# Altium project Modbus_controller.PrjPcb (part 1 of 2)
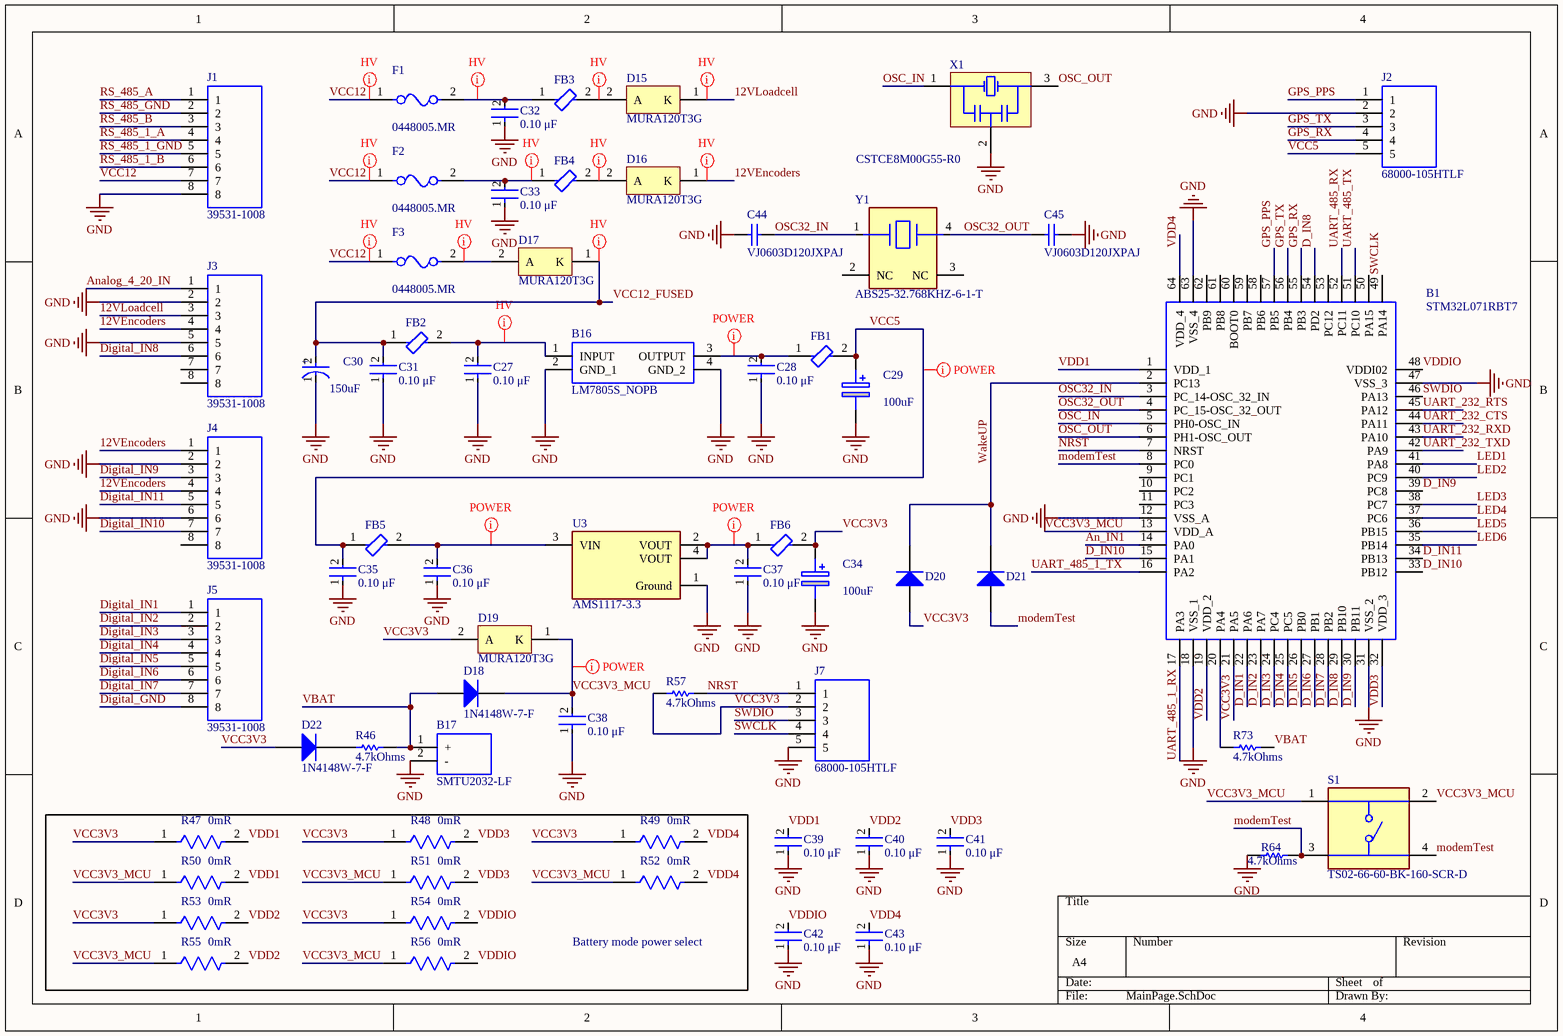
[diagram p0: MainPage.SchDoc]
6 sheets, 195 parts. Net scope: global (net labels, ports and power ports of the same name join across sheets).
Board file: Modbus_PCB1.PcbDoc
Sheets:
  MainPage.SchDoc
  RS_232.SchDoc
  InputCircuits.SchDoc
  InputCircuits1.SchDoc
  indication.SchDoc
  RS_485.SchDoc

## Sheet MainPage.SchDoc
size A4; SheetNumber: 1; SheetTotal: 6

### Parts
B1  STM32L071RBT7  [QFP50P1200X1200X160-64N]
B16  LM7805S_NOPB  [KTT0003B]
B17  SMTU2032-LF  [SMTU2032LF]
C27  value 0.10 μF  [FP-C0805C-DN-MFG]  (hidden comment: C0805C104K5RAC7411)
C28  value 0.10 μF  [FP-C0805C-DN-MFG]  (hidden comment: C0805C104K5RAC7411)
C29  Capacitance: 100uF  [T520B]  (hidden comment: T520B107M006ATE040)
C30  Capacitance: 150uF  [FP-TAJE-MFG]  (hidden comment: TAJE157K020RNJ)
C31  value 0.10 μF  [FP-C0805C-DN-MFG]  (hidden comment: C0805C104K5RAC7411)
C32  value 0.10 μF  [FP-C0805C-DN-MFG]  (hidden comment: C0805C104K5RAC7411)
C33  value 0.10 μF  [FP-C0805C-DN-MFG]  (hidden comment: C0805C104K5RAC7411)
C34  Capacitance: 100uF  [T520B]  (hidden comment: T520B107M006ATE040)
C35  value 0.10 μF  [FP-C0805C-DN-MFG]  (hidden comment: C0805C104K5RAC7411)
C36  value 0.10 μF  [FP-C0805C-DN-MFG]  (hidden comment: C0805C104K5RAC7411)
C37  value 0.10 μF  [FP-C0805C-DN-MFG]  (hidden comment: C0805C104K5RAC7411)
C38  value 0.10 μF  [FP-C0805C-DN-MFG]  (hidden comment: C0805C104K5RAC7411)
C39  value 0.10 μF  [FP-C0805C-DN-MFG]  (hidden comment: C0805C104K5RAC7411)
C40  value 0.10 μF  [FP-C0805C-DN-MFG]  (hidden comment: C0805C104K5RAC7411)
C41  value 0.10 μF  [FP-C0805C-DN-MFG]  (hidden comment: C0805C104K5RAC7411)
C42  value 0.10 μF  [FP-C0805C-DN-MFG]  (hidden comment: C0805C104K5RAC7411)
C43  value 0.10 μF  [FP-C0805C-DN-MFG]  (hidden comment: C0805C104K5RAC7411)
C44  VJ0603D120JXPAJ  [CAPC1608X92X38LL15T08]
C45  VJ0603D120JXPAJ  [CAPC1608X92X38LL15T08]
D15  MURA120T3G  [ONSC-SMA-2-403D-02_V]
D16  MURA120T3G  [ONSC-SMA-2-403D-02_V]
D17  MURA120T3G  [ONSC-SMA-2-403D-02_V]
D18  1N4148W-7-F  [DIOD-SOD123-2_V]
D19  MURA120T3G  [ONSC-SMA-2-403D-02_V]
D20  1N4148W-7-F  [DIOD-SOD123-2_V]  (value not drawn)
D21  1N4148W-7-F  [DIOD-SOD123-2_V]  (value not drawn)
D22  1N4148W-7-F  [DIOD-SOD123-2_V]
F1  0448005.MR  [FP-0448-MFG]
F2  0448005.MR  [FP-0448-MFG]
F3  0448005.MR  [FP-0448-MFG]
FB1  BLM41PG181SH1L  [FP-BLM41-0_2-a1_2-MFG]  (value not drawn)
FB2  BLM41PG181SH1L  [FP-BLM41-0_2-a1_2-MFG]  (value not drawn)
FB3  BLM41PG181SH1L  [FP-BLM41-0_2-a1_2-MFG]  (value not drawn)
FB4  BLM41PG181SH1L  [FP-BLM41-0_2-a1_2-MFG]  (value not drawn)
FB5  BLM41PG181SH1L  [FP-BLM41-0_2-a1_2-MFG]  (value not drawn)
FB6  BLM41PG181SH1L  [FP-BLM41-0_2-a1_2-MFG]  (value not drawn)
J1  39531-1008  [RHDR8W140P0X508_1X8_4264X830X1240P]
J2  68000-105HTLF  [HDRV5W67P0X254_1X5_1270X241X858P]
J3  39531-1008  [RHDR8W140P0X508_1X8_4264X830X1240P]
J4  39531-1008  [RHDR8W140P0X508_1X8_4264X830X1240P]
J5  39531-1008  [RHDR8W140P0X508_1X8_4264X830X1240P]
J7  68000-105HTLF  [HDRV5W67P0X254_1X5_1270X241X858P]
R46  Resistance: 4.7kOhms  [RESC1608X55X25LL10T15]  (hidden comment: RC0603FR-074K7L)
R47  Resistance: 0mR  [FP-CRCW0603-HPe3-MFG]  (hidden comment: CRCW06030000Z0EAHP)
R48  Resistance: 0mR  [FP-CRCW0603-HPe3-MFG]  (hidden comment: CRCW06030000Z0EAHP)
R49  Resistance: 0mR  [FP-CRCW0603-HPe3-MFG]  (hidden comment: CRCW06030000Z0EAHP)
R50  Resistance: 0mR  [FP-CRCW0603-HPe3-MFG]  (hidden comment: CRCW06030000Z0EAHP)
R51  Resistance: 0mR  [FP-CRCW0603-HPe3-MFG]  (hidden comment: CRCW06030000Z0EAHP)
R52  Resistance: 0mR  [FP-CRCW0603-HPe3-MFG]  (hidden comment: CRCW06030000Z0EAHP)
R53  Resistance: 0mR  [FP-CRCW0603-HPe3-MFG]  (hidden comment: CRCW06030000Z0EAHP)
R54  Resistance: 0mR  [FP-CRCW0603-HPe3-MFG]  (hidden comment: CRCW06030000Z0EAHP)
R55  Resistance: 0mR  [FP-CRCW0603-HPe3-MFG]  (hidden comment: CRCW06030000Z0EAHP)
R56  Resistance: 0mR  [FP-CRCW0603-HPe3-MFG]  (hidden comment: CRCW06030000Z0EAHP)
R57  Resistance: 4.7kOhms  [RESC1608X55X25LL10T15]  (hidden comment: RC0603FR-074K7L)
R64  Resistance: 4.7kOhms  [RESC1608X55X25LL10T15]  (hidden comment: RC0603FR-074K7L)
R73  Resistance: 4.7kOhms  [RESC1608X55X25LL10T15]  (hidden comment: RC0603FR-074K7L)
S1  TS02-66-60-BK-160-SCR-D  [SW_TS02-66-60-BK-160-SCR-D]
U3  AMS1117-3.3  [FP-AMS1117-IPC_C]
X1  CSTCE8M00G55-R0  [MURA-CSTCE_G_A-3_V]
Y1  ABS25-32.768KHZ-6-1-T  [FP-ABS25-MFG]

### Blocks framed on the sheet
Battery mode power select: R47-R56

### Nets
GND: B1.12(VSS_A) B1.18(VSS_1) B1.31(VSS_2) B1.47(VSS_3) B1.63(VSS_4) B16.2(GND_1) B16.4(GND_2) B17.2(-) C27.1 C28.1 C29.2(-) C30.1(C) C31.1 C32.1 C33.1 C34.2(-) C35.1 C36.1 C37.1 C38.1 C39.1 C40.1 C41.1 C42.1 C43.1 C44.1 C45.2 J1.8 J2.2 J3.2 J3.5 J4.2 J4.6 J7.5 R64.2 U3.1(Ground) X1.2(GND)
12VEncoders: D16.1(K) J3.4 J4.1 J4.4
12VLoadcell: D15.1(K) J3.3
An_IN1: B1.14(PA0)
Analog_4_20_IN: J3.1
D_IN1: B1.22(PA6)
D_IN2: B1.23(PA7)
D_IN3: B1.24(PC4)
D_IN4: B1.25(PC5)
D_IN5: B1.26(PB0)
D_IN6: B1.27(PB1)
D_IN7: B1.28(PB2)
D_IN8: B1.29(PB10) B1.54(PD2)
D_IN9: B1.30(PB11) B1.39(PC8)
D_IN10: B1.15(PA1) B1.33(PB12)
D_IN11: B1.34(PB13)
Digital_GND: J5.8
Digital_IN1: J5.1
Digital_IN2: J5.2
Digital_IN3: J5.3
Digital_IN4: J5.4
Digital_IN5: J5.5
Digital_IN6: J5.6
Digital_IN7: J5.7
Digital_IN8: J3.6
Digital_IN9: J4.3
Digital_IN10: J4.7
Digital_IN11: J4.5
GPS_PPS: B1.57(PB5) J2.1
GPS_RX: B1.55(PB3) J2.4
GPS_TX: B1.56(PB4) J2.3
LED1: B1.41(PA8)
LED2: B1.40(PC9)
LED3: B1.38(PC7)
LED4: B1.37(PC6)
LED5: B1.36(PB15)
LED6: B1.35(PB14)
modemTest: B1.8(PC0) D21.1(A) R64.1 S1.3 S1.4
NRST: B1.7(NRST) J7.1 R57.1
OSC32_IN: B1.3(PC_14-OSC_32_IN) C44.2 Y1.1
OSC32_OUT: B1.4(PC_15-OSC_32_OUT) C45.1 Y1.4
OSC_IN: B1.5(PH0-OSC_IN) X1.1(X1)
OSC_OUT: B1.6(PH1-OSC_OUT) X1.3(X2)
RS_485_1_A: J1.4
RS_485_1_B: J1.6
RS_485_1_GND: J1.5
RS_485_A: J1.1
RS_485_B: J1.3
RS_485_GND: J1.2
SWCLK: B1.49(PA14) J7.4
SWDIO: B1.46(PA13) J7.3
UART_232_CTS: B1.44(PA11)
UART_232_RTS: B1.45(PA12)
UART_232_RXD: B1.43(PA10)
UART_232_TXD: B1.42(PA9)
UART_485_1_RX: B1.17(PA3)
UART_485_1_TX: B1.16(PA2)
UART_485_RX: B1.52(PC11)
UART_485_TX: B1.51(PC10)
VBAT: B17.1(+) D18.1(A) R46.1 R73.1
VCC3V3: B1.21(PA5) C34.1(+) D19.2(A) D20.1(A) D22.1(A) FB6.2 J7.2 R47.1 R48.1 R49.1 R53.1 R54.1 R57.2
VCC3V3_MCU: B1.13(VDD_A) C38.2 D18.2(K) D19.1(K) R50.1 R51.1 R52.1 R55.1 R56.1 S1.1 S1.2
VCC5: C29.1(+) C35.2 FB1.2 FB5.1 J2.5
VCC12: F1.1 F2.1 F3.1 J1.7
VCC12_FUSED: C30.2(A) C31.2 D17.1(K) FB2.1
VDD1: B1.1(VDD_1) C39.2 R47.2 R50.2
VDD2: B1.19(VDD_2) C40.2 R53.2 R55.2
VDD3: B1.32(VDD_3) C41.2 R48.2 R51.2
VDD4: B1.64(VDD_4) C43.2 R49.2 R52.2
VDDIO: B1.48(VDDI02) C42.2 R54.2 R56.2
WakeUP: B1.2(PC13) D20.2(K) D21.2(K)
NetB1_20: B1.20(PA4) R73.2
NetB16_1: B16.1(INPUT) C27.2 FB2.2
NetB16_3: B16.3(OUTPUT) C28.2 FB1.1
NetC32_2: C32.2 F1.2 FB3.1
NetC33_2: C33.2 F2.2 FB4.1
NetC36_2: C36.2 FB5.2 U3.3(VIN)
NetC37_2: C37.2 FB6.1 U3.2(VOUT) U3.4(VOUT)
NetD15_2: D15.2(A) FB3.2
NetD16_2: D16.2(A) FB4.2
NetD17_2: D17.2(A) F3.2
NetD22_2: D22.2(K) R46.2

Not connected (* = marked no-connect by the designer): B1 9(PC1) 10(PC2) 11(PC3) 50(PA15) 53(PC12) 58(PB6) 59(PB7) 60(BOOT0) 61(PB8) 62(PB9); J3 7 8; J4 8; Y1 2(NC) 3(NC)

### Layout directives
net class HV: 12VEncoders, 12VLoadcell, NetB16_1, NetC32_2, NetC33_2, NetD15_2, NetD16_2, NetD17_2, VCC12, VCC12_FUSED
net class POWER: NetB16_3, NetC36_2, NetC37_2, VCC3V3_MCU, VCC5

### Notes on the sheet
- (in symbol CMP-2000-07229-2) +

### Library data of the parts
B1 = STM32L071RBT7: ARM Microcontrollers - MCU 16/32-BITS MICROS; Manufacturer_Name: STMicroelectronics; Geometry.Height: 1.6mm; Mouser Part Number: 511-STM32L071RBT7; Mouser Price/Stock: https://www.mouser.co.uk/ProductDetail/STMicroelectronics/STM32L071RBT7?qs=qzCNEk%252BRr%252BZjEtOUFC%252Bu7w%3D%3D; Manufacturer_Part_Number: STM32L071RBT7; Datasheet Link: http://www.st.com/content/ccc/resource/technical/document/datasheet/b5/24/80/11/51/59/47/f7/DM00141136.pdf/files/DM00141136.pdf/jcr:content/translations/en.DM00141136.pdf
B16 = LM7805S_NOPB: 1.5-A, Wide VIN Fixed Voltage Regulators; Manufacturer_Name: Texas Instruments; Manufacturer_Part_Number: LM7805S/NOPB; Mouser Part Number: 595-LM7805S/NOPB; Mouser Price/Stock: https://www.mouser.co.uk/ProductDetail/Texas-Instruments/LM7805S-NOPB?qs=9V2QonpqdTu8D%252Bva6DasHQ%3D%3D; Datasheet Link: http://www.ti.com/lit/gpn/lm7800
B17 = SMTU2032-LF: Coin Cell Battery Holders SFC MNT FOR CR2032; Manufacturer_Name: RENATA; Geometry.Height: 5mm; Mouser Part Number: 614-SMTU2032-LF; Mouser Price/Stock: https://www.mouser.co.uk/ProductDetail/Renata/SMTU2032-LF?qs=r1PAtlylphCLeXbokB9Tog%3D%3D; Manufacturer_Part_Number: SMTU2032-LF; Datasheet Link: https://componentsearchengine.com/Datasheets/1/SMTU2032-LF.pdf
C27 C28 C31-C33 C35-C43 = CMP-2007-00277-3: C0805 0.10 μF X7R 30ppm/°C 10.00% 50 V; Manufacturer: KEMET; Material: Ceramic; Tolerance: 0.1; Voltage Rating: 50 V; Temperature: -55°C to +125°C; Device Class L3: Ceramic Capacitors; Temperature Characteristic: X7R; Device Class L1: Passive Components; Category: Cap; Temperature Coefficient: 30ppm/°C; Manufacturer Part Number: C0805C104K5RAC7411; Temperature Range High: +125°C; Height: 0.88mm; RoHS: TRUE; ComponentLink2Description: Datasheet; Lead Free: Yes; Capacitance: 0.10 μF; Package: C0805C-DN; Temperature Range Low: -55°C; ComponentLink2URL: https://content.kemet.com/datasheets/KEM_C1003_C0G_SMD.pdf; Automotive: No; Ipc Land Pattern Name: CAPC200125X78; Octopart: https://octopart.com/c0805c104k5rac7411-kemet-18508045; Device Class L2: Capacitors
C29 C34 = T520B107M006ATE040: T520, Tantalum, Polymer Tantalum, Commercial Grade, 100 uF, 20%, 6.3 VDC, 105C, -55C, 105C, SMD, Polymer, Molded, Low ESR, Non-Combustible, 2,000 Hrs, 8 % , 40 mOhms, 63 uA, 94.85 mg, 3528, 1.9mm, Height Max = 2mm, 2000, 52  Weeks; Manufacturer_Name: KEMET; Mouser Part Number: 80-T520B107M6ATE40; Mouser Price/Stock: https://www.mouser.co.uk/ProductDetail/KEMET/T520B107M006ATE040?qs=A%2FUypIgi4aDLVIJ%2FABrGAw%3D%3D; Manufacturer_Part_Number: T520B107M006ATE040; Datasheet Link: https://content.kemet.com/datasheets/KEM_T2076_T52X-530.pdf; Geometry.Height: 2mm
C30 = CMP-2000-07229-2: 150uF 20V  ±10% 300mΩ 2917  SMD Tantalum Capacitor; Dissipation Factor: 8%; ESR (Equivalent Series Resistance): 300mR; Polarity: Polar; Leakage Current: 30uA; Dielectric Material: Tantalum; Height: 4.3mm; RoHS Compliant: Yes; Mount: Surface Mount; Voltage Rating: 20V; REACH SVHC: No SVHC; Height - Seated (Max): 0.169inch; Case Code (Imperial): 2917; Termination: SMD/SMT; Features: General Purpose; Case/Package: 2917; Max Operating Temperature: 125°C; Length: 7.3mm; Width: 4.3mm; Radiation Hardening: No; Construction: Flat; Voltage Rating (DC): 20V; Lead Free: Lead Free; Depth: 4.3mm; Tolerance: 10%; Series: TAJ; Min Operating Temperature: -55°C; Package Quantity: 1; Number of Pins: 2; Packaging: Tape and Reel; Case Code (Metric): 7343
C44 C45 = CMP-2006-01491-1: Manufacturer: Vitramon; Part Number: VJ0603D120JXPAJ
D15-D17 D19 = CMP-0902-00292-1: Surface Mount Ultrafast Power Rectifier, 2-Pin SMA, Pb-Free, Tape and Reel; Manufacturer: On Semiconductor; IFSM Max (A): 40; RoHS: TRUE; PackageVersion: Rev. G, 07/2012; DatasheetVersion: Rev. 8; Packing: Tape and Reel; ComponentLink2Description: Datasheet; ComponentLink3Description: Package Specification; ComponentLink2URL: http://www.onsemi.cn/pub_link/Collateral/MURA115T3-D.PDF; ComponentLink1URL: http://www.onsemi.com/; PartNumber: MURA120T3G; ComponentLink1Description: Manufacturer URL; Mounting Technology: Surface Mount; PackageDescription: 2-Pin Small Molded Package, J-Bend Lead, Body 2.605 x 4.315 mm; ComponentLink3URL: http://www.onsemi.com/pub_link/Collateral/403D-02.PDF; Type: Ultrafast; PackageReference: SMA-2-403D-02
D18 D20-D22 = CMP-2000-04932-2: Fast Switching Diode, 100 V, 0.15 A, -65 to 150 degC, 2-Pin?SOD123, RoHS, Tape and Reel; Recovery Time: 4ns; Brand: DiodesIncorporated; Unit Weight: 0.000353oz; Max Surge Current: 2A; Peak Reverse Voltage: 100V; Ir - Reverse Current: 1uA; Vf - Forward Voltage: 1.25V; Configuration: Single; If - Forward Current: 0.15A; Product Category: Diodes-GeneralPurpose,Power,Switching; Operating Temperature Range: -65Cto+150C; Packaging: Reel; Manufacturer URL: http://www.diodes.com/; Maximum Operating Temperature: +150C; Height: 1.25mm; Minimum Operating Temperature: -65C; Product: SwitchingDiodes; Package URL: http://www.diodes.com/datasheets/ds18004.pdf; Type: SwitchingDiode; Package Reference: SOD123-2; Width: 1.7mm; Datasheet URL: http://www.farnell.com/datasheets/1915529.pdf; Datasheet Version: Rev. 24-2, 10/2013; Series: 1N4148; Factory Pack Quantity: 3000; Length: 2.85mm; RoHS: True; Manufacturer: DiodesIncorporated; Mounting Style: SMD/SMT; Package / Case: SOD-123
F1-F3 = CMP-2000-05188-2: FUSE BRD MNT 5A 125VAC/VDC 2SMD; Manufacturer: Littelfuse; Max Fuse Ac Voltage: 125V; Fuse Blow Speed: Fast; Fuse Interrupt Ac Current: 50A; Value: 0.01531Ω; Fuse I2T: 4.49A2Sec; Device Class L3: unset; Lead Free: Yes; RoHS: TRUE; Max Fuse Dc Voltage: 125V; Mouser Description: Fuse Chip Very Fast Acting 5A 125V SMD Solder Pad 2410 Ceramic T/R CSA/PSE/UL; Package: 0448; Manufacturer Part Number: 0448005.MR; Device Class L2: Fuses; Fuse Current: 5A; Device Class L1: Circuit Protection; Octopart: https://octopart.com/0448005.mr-littelfuse-672815; ComponentLink2URL: https://www.littelfuse.com/~/media/electronics/datasheets/fuses/littelfuse_fuse_448_datasheet.pdf.pdf; Automotive: No; Digikey Description: FUSE BRD MNT 5A 125VAC/VDC 2SMD; Resistance: 0.01531Ω; Fuse Interrupt Dc Current: 50A; Temperature Range High: +125°C; Temperature: -55°C to +125°C; Voltage Rating: 125V; Category: Fuse; Height: 2.94mm; ComponentLink2Description: Datasheet; Temperature Range Low: -55°C
FB1-FB6 = CMP-06046-002023-1: Ferrite Bead, 1806, 180Ω @ 100MHz, 25%, 0.02Ω, 3.5A; Impedance: 180R; Number of Lines: 1; Max DC Current: 50mA; DC Resistance (DCR): 20mR; Mount: Surface Mount; Length: 4.5mm; Tolerance: 25%; Series: EMIFIL®, BLM41P; Package Quantity: 2500; Min Operating Temperature: -55°C; Max Operating Temperature: 125°C; Height: 0.071inch; Packaging: Tape and Reel; Contact Plating: Tin; Test Frequency: 100MHz; Ratings: AEC-Q200; Case Code (Metric): 4516; Termination: SMD/SMT; Case Code (Imperial): 1806; Width: 0.063inch; Max Current Rating: 3.5A; Case/Package: 1806
J1 J3-J5 = 39531-1008: Pluggable Terminal Blocks 5.08MM EURO HEADER VERT BLK 8CKT; Manufacturer_Name: Molex; Geometry.Height: 12.4mm; Mouser Part Number: 538-39531-1008; Mouser Price/Stock: https://www.mouser.co.uk/ProductDetail/Molex/39531-1008?qs=cJvWYcaovXy3iX%252BVkyK%252Bcg%3D%3D; Manufacturer_Part_Number: 39531-1008; Datasheet Link: https://www.molex.com/pdm_docs/sd/395311008_sd.pdf
J2 J7 = 68000-105HTLF: 68000-105HTLF-B/S SR HDR 1*5; Manufacturer_Name: Amphenol Communication Solutions; Geometry.Height: 8.58mm; Mouser Part Number: 649-68000-105HTLF; Mouser Price/Stock: https://www.mouser.co.uk/ProductDetail/Amphenol-FCI/68000-105HTLF?qs=w%2Fv1CP2dgqrYgNyQVoiqDw%3D%3D; Manufacturer_Part_Number: 68000-105HTLF; Datasheet Link: https://cdn.amphenol-cs.com/media/wysiwyg/files/drawing/68000.pdf
R46 R57 R64 R73 = CMP-2000-06942-1: Chip Resistor, 4.7 KOhm, +/- 1%, 0.1 W, -55 to 155 degC, 0603 (1608 Metric), RoHS, Tape and Reel; Manufacturer: Yageo; Power Rating: 100mW; Temperature Coefficient: 100PPM/C; Voltage Rating: 50V; Package Reference: 0603; Series: RC; Datasheet Version: Rev. 7, 05/2017; Packaging: Reel; Termination Style: SMD/SMT; Datasheet URL: http://www.yageo.com/documents/recent/PYu-RC_Group_51_RoHS_L_7.pdf; Manufacturer URL: http://www.yageo.com/; Package Description: 2-Pin Surface Mount Device, Body 1.6 x 0.8 mm; Case Code - mm: 1608; Case Code - in: 0603; Mounting Technology: SurfaceMount; Operating Temperature Range: -55Cto+155C; Tolerance: 1%; Product: ThickFilmResistorsGeneralPurpose
R47-R56 = CMP-2000-03817-2: RES Thick Film, 0Ω, , 0.33W, , 0603; Max Power Dissipation: 250mW; Voltage Rating (DC): 75V; Temperature Coefficient: 0ppm/°C; Mount: Surface Mount; Package Quantity: 5000; Features: Automotive AEC-Q200; Length: 1.6mm; Width: 0.033inch; Min Operating Temperature: -55°C; Max Operating Temperature: 155°C; Contact Plating: Tin; Depth: 0.85mm; Case/Package: 0603; Radiation Hardening: No; Military Standard: Not; Power Rating: 250mW; Height: 0.45mm; Composition: Thick Film; Lead Free: Lead Free; Voltage Rating: 75V; Case Code (Imperial): 0603; Weight: 7.1E-05oz; Number of Terminations: 2; Packaging: Tape and Reel; Number of Pins: 2; Case Code (Metric): 1608; Termination: SMD/SMT
U3 = CMP-209535-000001-1: LDO Voltage Regulators 1A, 3.3V; Manufacturer: Advanced Monolithic Systems; Dropout Voltage: 1.1V; Output Type: Fixed; Nominal Supply Current: 5mA; Max Power Dissipation: 1.2W; Max Supply Voltage: 15V; Number Of Outputs: 1; Standoff Height: 0.64mm; Max Junction Temp: +125°C; Height: 1.8mm; Package: AMS1117; Device Class L2: Power Management ICs; ComponentLink2Description: Datasheet; ComponentLink2URL: http://www.advanced-monolithic.com/pdf/ds1117.pdf; Category: IC; RoHS: TRUE; Automotive: No; Device Class L1: Integrated Circuits (ICs); Output Current: 1A; Device Class L3: Voltage Regulators - Linear; Temperature: -40°C to +125°C; Output Voltage: 3.3V; Manufacturer Part Number: AMS1117-3.3; Temperature Range Low: -40°C; Octopart: https://octopart.com/ams1117-3.3-advanced+monolithic+systems-25899300; Lead Free: Yes; Ipc Land Pattern Name: SOT229P700X180-4; Temperature Range High: +125°C
X1 = CMP-2100-03620-1: Ceramic Resonator, 8 MHz, +/- 0.5%, -20 to 80 degC, 3-Pin SMD, RoHS, Tape and Reel; Manufacturer: Murata; Capacitance: 33pF; Frequency Stability: 0.2%; Self Resonant Frequency: 8MHz; Datasheet Version: 42339.0; RoHSCompliant: True; Datasheet URL: http://www.murata.com/~/media/webrenewal/support/library/catalog/products/timingdevice/ceralock/p16e.ashx; Case/Package: Ceramic; Load Capacitance: 33pF; Tolerance: 0.5%; Mount: SurfaceMount; Height: 0.031inch; Number of Pins: 3; Package Description: 3-Pin Surface Mount Device, Body 3.2 x 1.3 mm, Pitch 1.2 mm; Package Quantity: 1; Lead Free: LeadFree; Contact Plating: Gold; REACH SVHC: NoSVHC; Length: 0.126inch; Width: 0.051inch; Manufacturer URL: http://www.murata.com/; Packaging: TapeandReel; Termination: SMD/SMT; Frequency Tolerance: 0.5%; Max Operating Temperature: 80degC; Composition: Ceramic; Package Reference: CSTCE_G_A-3; Min Operating Temperature: -20degC; Frequency: 8MHz
Y1 = CMP-27762-013076-1: CRYSTAL 32.7680KHZ 6PF SMD; ESR (Equivalent Series Resistance): 50kR; Frequency Tolerance: 10ppm; Series Resistance: 50kR; Frequency: 32.768kHz; Length: 8mm; Load Capacitance: 6pF; Packaging: Tape and Reel; Radiation Hardening: No; Min Operating Temperature: -40°C; Lead Free: Lead Free; Height: 0.098inch; Termination: SMD/SMT; Case/Package: SMD/SMT; Max Operating Temperature: 85°C; Mount: Surface Mount; Depth: 3.8mm; RoHS Compliant: Yes; Series: ABS25; Package Quantity: 3000; Operating Frequency: 32.768 kHz; Number of Pins: 4; Tolerance: 10ppm; Width: 0.15inch; REACH SVHC: No SVHC
S1 = TS02-66-60-BK-160-SCR-D: Price: None; MP: TS02-66-60-BK-160-SCR-D; Availability: Unavailable; Package: None; Value: *

## Sheet RS_232.SchDoc
size A4; SheetNumber: 2; SheetTotal: 6
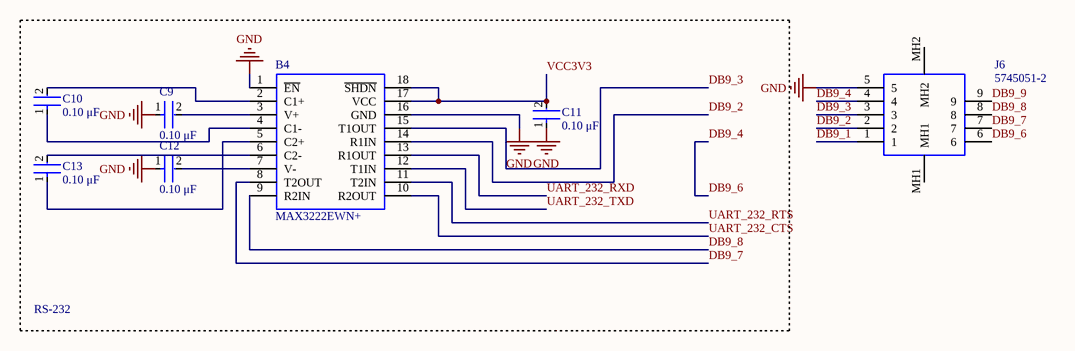
[diagram p1: RS_232.SchDoc]

### Parts
B4  MAX3222EWN+  [SOIC127P1032X265-18N]
C9  value 0.10 μF  [FP-C0805C-DN-MFG]  (hidden comment: C0805C104K5RAC7411)
C10  value 0.10 μF  [FP-C0805C-DN-MFG]  (hidden comment: C0805C104K5RAC7411)
C11  value 0.10 μF  [FP-C0805C-DN-MFG]  (hidden comment: C0805C104K5RAC7411)
C12  value 0.10 μF  [FP-C0805C-DN-MFG]  (hidden comment: C0805C104K5RAC7411)
C13  value 0.10 μF  [FP-C0805C-DN-MFG]  (hidden comment: C0805C104K5RAC7411)
J6  5745051-2  [57450512]

### Blocks framed on the sheet
RS-232: B4 C9-C13

### Nets
GND: B4.1(~{EN}) B4.16(GND) C9.1 C11.1 C12.1 J6.5
DB9_1: J6.1
DB9_2: B4.14(R1IN) J6.2
DB9_3: B4.15(T1OUT) J6.3
DB9_4: J6.4 J6.6  [also labelled DB9_6]
DB9_7: B4.8(T2OUT) J6.7
DB9_8: B4.9(R2IN) J6.8
DB9_9: J6.9
UART_232_CTS: B4.10(R2OUT)
UART_232_RTS: B4.11(T2IN)
UART_232_RXD: B4.13(R1OUT)
UART_232_TXD: B4.12(T1IN)
VCC3V3: B4.17(VCC) B4.18(~{SHDN}) C11.2
NetB4_2: B4.2(C1+) C10.2
NetB4_3: B4.3(V+) C9.2
NetB4_4: B4.4(C1-) C10.1
NetB4_5: B4.5(C2+) C13.1
NetB4_6: B4.6(C2-) C13.2
NetB4_7: B4.7(V-) C12.2

Not connected (* = marked no-connect by the designer): J6 MH1 MH2

### Library data of the parts
B4 = MAX3222EWN+: RS-232 Interface IC 3.0V to 5.5V, Low-Power, up to 1Mbps, True RS-232 Transceivers Using Four 0.1 uF External Capacitors; Manufacturer_Name: Maxim Integrated; Geometry.Height: 2.65mm; Mouser Part Number: 700-MAX3222EWN; Mouser Price/Stock: https://www.mouser.co.uk/ProductDetail/Maxim-Integrated/MAX3222EWN%2b?qs=CDqwynd4ZNrAONYHXo3EOQ%3D%3D; Manufacturer_Part_Number: MAX3222EWN+; Datasheet Link: https://pdfserv.maximintegrated.com/en/ds/MAX3222-MAX3241.pdf
C9-C13 = CMP-2007-00277-3: as C27 on sheet MainPage; Temperature: -55°C to +125°C; Device Class L3: Ceramic Capacitors; Temperature Characteristic: X7R; Device Class L1: Passive Components; Category: Cap; Temperature Coefficient: 30ppm/°C; Manufacturer Part Number: C0805C104K5RAC7411; Temperature Range High: +125°C; Height: 0.88mm; RoHS: TRUE; ComponentLink2Description: Datasheet; Lead Free: Yes; Capacitance: 0.10 μF; Package: C0805C-DN; Temperature Range Low: -55°C; ComponentLink2URL: https://content.kemet.com/datasheets/KEM_C1003_C0G_SMD.pdf; Automotive: No; Ipc Land Pattern Name: CAPC200125X78; Octopart: https://octopart.com/c0805c104k5rac7411-kemet-18508045; Device Class L2: Capacitors
J6 = 5745051-2: HD-20 PLUG 9P VERT THD INS; Manufacturer_Name: TE Connectivity; Geometry.Height: 12.47mm; Mouser Part Number: 571-5745051-2; Mouser Price/Stock: https://www.mouser.co.uk/ProductDetail/TE-Connectivity/5745051-2?qs=FlGfrDooHc0LdF1RZqeXpw%3D%3D; Manufacturer_Part_Number: 5745051-2; Datasheet Link: https://www.te.com/commerce/DocumentDelivery/DDEController?Action=showdoc&DocId=Customer+Drawing%7F5745051%7FA1%7Fpdf%7FEnglish%7FENG_CD_5745051_A1.pdf%7F5745051-2

## Sheet InputCircuits.SchDoc
size A4; SheetNumber: 3; SheetTotal: 6
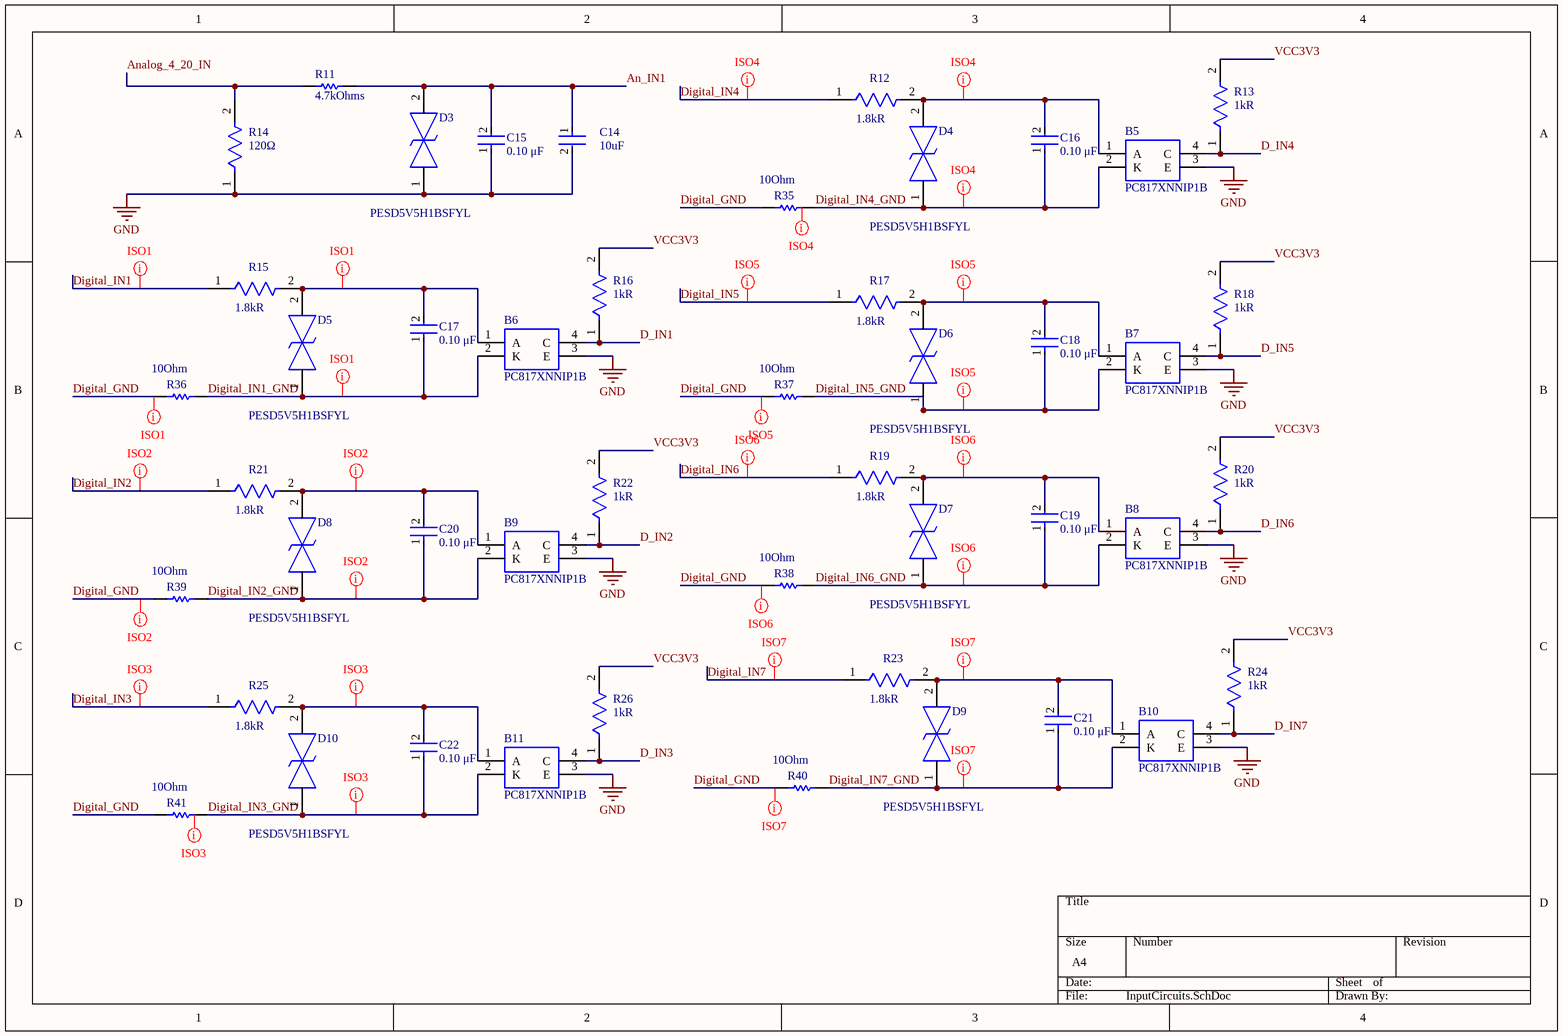
[diagram p2: InputCircuits.SchDoc]

### Parts
B5  PC817XNNIP1B  [SOP254P960X420-4N]
B6  PC817XNNIP1B  [SOP254P960X420-4N]
B7  PC817XNNIP1B  [SOP254P960X420-4N]
B8  PC817XNNIP1B  [SOP254P960X420-4N]
B9  PC817XNNIP1B  [SOP254P960X420-4N]
B10  PC817XNNIP1B  [SOP254P960X420-4N]
B11  PC817XNNIP1B  [SOP254P960X420-4N]
C14  Capacitance: 10uF  [FP-MK212G-MFG]  (hidden comment: LMK212B7106KG-TD)
C15  value 0.10 μF  [FP-C0805C-DN-MFG]  (hidden comment: C0805C104K5RAC7411)
C16  value 0.10 μF  [FP-C0805C-DN-MFG]  (hidden comment: C0805C104K5RAC7411)
C17  value 0.10 μF  [FP-C0805C-DN-MFG]  (hidden comment: C0805C104K5RAC7411)
C18  value 0.10 μF  [FP-C0805C-DN-MFG]  (hidden comment: C0805C104K5RAC7411)
C19  value 0.10 μF  [FP-C0805C-DN-MFG]  (hidden comment: C0805C104K5RAC7411)
C20  value 0.10 μF  [FP-C0805C-DN-MFG]  (hidden comment: C0805C104K5RAC7411)
C21  value 0.10 μF  [FP-C0805C-DN-MFG]  (hidden comment: C0805C104K5RAC7411)
C22  value 0.10 μF  [FP-C0805C-DN-MFG]  (hidden comment: C0805C104K5RAC7411)
D3  PESD5V5H1BSFYL  [PESD5V0H1BSFYL]
D4  PESD5V5H1BSFYL  [PESD5V0H1BSFYL]
D5  PESD5V5H1BSFYL  [PESD5V0H1BSFYL]
D6  PESD5V5H1BSFYL  [PESD5V0H1BSFYL]
D7  PESD5V5H1BSFYL  [PESD5V0H1BSFYL]
D8  PESD5V5H1BSFYL  [PESD5V0H1BSFYL]
D9  PESD5V5H1BSFYL  [PESD5V0H1BSFYL]
D10  PESD5V5H1BSFYL  [PESD5V0H1BSFYL]
R11  Resistance: 4.7kOhms  [RESC1608X55X25LL10T15]  (hidden comment: RC0603FR-074K7L)
R12  Resistance: 1.8kR  [FP-RC0603-0_55-IPC_C]  (hidden comment: RC0603FR-071K8L)
R13  Resistance: 1kR  [FP-RC0603-0_55-IPC_C]  (hidden comment: RC0603FR-071KL)
R14  Resistance: 120Ω  [FP-RT1206-MFG]  (hidden comment: RT1206FRE07120RL)
R15  Resistance: 1.8kR  [FP-RC0603-0_55-IPC_C]  (hidden comment: RC0603FR-071K8L)
R16  Resistance: 1kR  [FP-RC0603-0_55-IPC_C]  (hidden comment: RC0603FR-071KL)
R17  Resistance: 1.8kR  [FP-RC0603-0_55-IPC_C]  (hidden comment: RC0603FR-071K8L)
R18  Resistance: 1kR  [FP-RC0603-0_55-IPC_C]  (hidden comment: RC0603FR-071KL)
R19  Resistance: 1.8kR  [FP-RC0603-0_55-IPC_C]  (hidden comment: RC0603FR-071K8L)
R20  Resistance: 1kR  [FP-RC0603-0_55-IPC_C]  (hidden comment: RC0603FR-071KL)
R21  Resistance: 1.8kR  [FP-RC0603-0_55-IPC_C]  (hidden comment: RC0603FR-071K8L)
R22  Resistance: 1kR  [FP-RC0603-0_55-IPC_C]  (hidden comment: RC0603FR-071KL)
R23  Resistance: 1.8kR  [FP-RC0603-0_55-IPC_C]  (hidden comment: RC0603FR-071K8L)
R24  Resistance: 1kR  [FP-RC0603-0_55-IPC_C]  (hidden comment: RC0603FR-071KL)
R25  Resistance: 1.8kR  [FP-RC0603-0_55-IPC_C]  (hidden comment: RC0603FR-071K8L)
R26  Resistance: 1kR  [FP-RC0603-0_55-IPC_C]  (hidden comment: RC0603FR-071KL)
R35  Resistance: 10Ohm  [RESC2013X60X35ML10T20]  (hidden comment: RC0805FR-0710RL)
R36  Resistance: 10Ohm  [RESC2013X60X35ML10T20]  (hidden comment: RC0805FR-0710RL)
R37  Resistance: 10Ohm  [RESC2013X60X35ML10T20]  (hidden comment: RC0805FR-0710RL)
R38  Resistance: 10Ohm  [RESC2013X60X35ML10T20]  (hidden comment: RC0805FR-0710RL)
R39  Resistance: 10Ohm  [RESC2013X60X35ML10T20]  (hidden comment: RC0805FR-0710RL)
R40  Resistance: 10Ohm  [RESC2013X60X35ML10T20]  (hidden comment: RC0805FR-0710RL)
R41  Resistance: 10Ohm  [RESC2013X60X35ML10T20]  (hidden comment: RC0805FR-0710RL)

### Nets
GND: B5.3(E) B6.3(E) B7.3(E) B8.3(E) B9.3(E) B10.3(E) B11.3(E) C14.2 C15.1 D3.1 R14.1
An_IN1: C14.1 C15.2 D3.2 R11.1
Analog_4_20_IN: R11.2 R14.2
D_IN1: B6.4(C) R16.1
D_IN2: B9.4(C) R22.1
D_IN3: B11.4(C) R26.1
D_IN4: B5.4(C) R13.1
D_IN5: B7.4(C) R18.1
D_IN6: B8.4(C) R20.1
D_IN7: B10.4(C) R24.1
Digital_GND: R35.1 R36.1 R37.1 R38.1 R39.1 R40.1 R41.1
Digital_IN1: R15.1
Digital_IN1_GND: B6.2(K) C17.1 D5.1 R36.2
Digital_IN2: R21.1
Digital_IN2_GND: B9.2(K) C20.1 D8.1 R39.2
Digital_IN3: R25.1
Digital_IN3_GND: B11.2(K) C22.1 D10.1 R41.2
Digital_IN4: R12.1
Digital_IN4_GND: B5.2(K) C16.1 D4.1 R35.2
Digital_IN5: R17.1
Digital_IN5_GND: B7.2(K) C18.1 D6.1 R37.2
Digital_IN6: R19.1
Digital_IN6_GND: B8.2(K) C19.1 D7.1 R38.2
Digital_IN7: R23.1
Digital_IN7_GND: B10.2(K) C21.1 D9.1 R40.2
VCC3V3: R13.2 R16.2 R18.2 R20.2 R22.2 R24.2 R26.2
NetB5_1: B5.1(A) C16.2 D4.2 R12.2
NetB6_1: B6.1(A) C17.2 D5.2 R15.2
NetB7_1: B7.1(A) C18.2 D6.2 R17.2
NetB8_1: B8.1(A) C19.2 D7.2 R19.2
NetB9_1: B9.1(A) C20.2 D8.2 R21.2
NetB10_1: B10.1(A) C21.2 D9.2 R23.2
NetB11_1: B11.1(A) C22.2 D10.2 R25.2

### Layout directives
net class ISO1: Digital_GND, Digital_IN1, Digital_IN1_GND, NetB6_1
net class ISO2: Digital_GND, Digital_IN2, Digital_IN2_GND, NetB9_1
net class ISO3: (no net found under the mark), Digital_IN3, Digital_IN3_GND, NetB11_1
net class ISO4: (no net found under the mark), Digital_IN4, Digital_IN4_GND, NetB5_1
net class ISO5: Digital_GND, Digital_IN5, Digital_IN5_GND, NetB7_1
net class ISO6: Digital_GND, Digital_IN6, Digital_IN6_GND, NetB8_1
net class ISO7: Digital_GND, Digital_IN7, Digital_IN7_GND, NetB10_1

### Library data of the parts
B5-B11 = PC817XNNIP1B: Transistor Output Optocouplers Photocoupler; Manufacturer_Name: Sharp Microelectronics; Geometry.Height: 4.2mm; Mouser Part Number: 852-PC817XNNIP1B; Mouser Price/Stock: https://www.mouser.co.uk/ProductDetail/Sharp-Microelectronics/PC817XNNIP1B?qs=rrS6PyfT74dJvnx7366b6Q%3D%3D; Manufacturer_Part_Number: PC817XNNIP1B; Datasheet Link: *
C14 = CMP-2000-06556-2: CAP CER 10UF 10V X7R 0805; Tolerance: 10%; Number of Pins: 2; Height: 1.25mm; Length: 0.079inch; Case Code (Metric): 2012; Thickness: 0.053inch; Width: 0.049inch; Dielectric: X7R; Case Code (Imperial): 0805; Case/Package: 0805; Termination: SMD/SMT; Resistor Type: Ceramic; Lead Free: Lead Free; Voltage Rating: 10V; Package Quantity: 1; Max Operating Temperature: 125°C; RoHS Compliant: Yes; Series: M; Packaging: Tape and Reel; Mount: Surface Mount; Min Operating Temperature: -55°C; Voltage Rating (DC): 10V
C15-C22 = CMP-2007-00277-3: as C27 on sheet MainPage; Temperature: -55°C to +125°C; Device Class L3: Ceramic Capacitors; Temperature Characteristic: X7R; Device Class L1: Passive Components; Category: Cap; Temperature Coefficient: 30ppm/°C; Manufacturer Part Number: C0805C104K5RAC7411; Temperature Range High: +125°C; Height: 0.88mm; RoHS: TRUE; ComponentLink2Description: Datasheet; Lead Free: Yes; Capacitance: 0.10 μF; Package: C0805C-DN; Temperature Range Low: -55°C; ComponentLink2URL: https://content.kemet.com/datasheets/KEM_C1003_C0G_SMD.pdf; Automotive: No; Ipc Land Pattern Name: CAPC200125X78; Octopart: https://octopart.com/c0805c104k5rac7411-kemet-18508045; Device Class L2: Capacitors
D3-D10 = PESD5V5H1BSFYL: ESD Suppressors / TVS Diodes; Manufacturer_Name: Nexperia; Geometry.Height: 0.325mm; Mouser Part Number: 771-PESD5V5H1BSFYL; Mouser Price/Stock: https://www.mouser.co.uk/ProductDetail/Nexperia/PESD5V5H1BSFYL?qs=T3oQrply3y9CfA%2FMHqAcog%3D%3D; Manufacturer_Part_Number: PESD5V5H1BSFYL; Datasheet Link: https://assets.nexperia.com/documents/data-sheet/PESD5V0H1BSF.pdf
R11 = CMP-2000-06942-1: as R46 on sheet MainPage; Package Reference: 0603; Series: RC; Datasheet Version: Rev. 7, 05/2017; Packaging: Reel; Termination Style: SMD/SMT; Datasheet URL: http://www.yageo.com/documents/recent/PYu-RC_Group_51_RoHS_L_7.pdf; Manufacturer URL: http://www.yageo.com/; Package Description: 2-Pin Surface Mount Device, Body 1.6 x 0.8 mm; Case Code - mm: 1608; Case Code - in: 0603; Mounting Technology: SurfaceMount; Operating Temperature Range: -55Cto+155C; Tolerance: 1%; Product: ThickFilmResistorsGeneralPurpose
R12 R15 R17 R19 R21 R23 R25 = CMP-2000-06931-2: RES SMD 1.8K OHM 1% 1/10W 0603; Power Rating: 100mW; Voltage Rating (DC): 50V; Temperature Coefficient: 100ppm/°C; REACH SVHC: No SVHC; Construction: Rectangular; Resistance Tolerance: 1%; Package Quantity: 5000; Tolerance: 1%; Min Operating Temperature: -55°C; Case Code (Metric): 1608; Number of Terminations: 2; Case/Package: 0603; Number of Pins: 2; Max Power Dissipation: 100mW; Max Operating Temperature: 155°C; Technology: THICK FILM; Resistor Type: Thick Film; Voltage Rating: 50V; Depth: 0.8mm; Size Code: 0603; Width: 0.8mm; Features: Moisture Resistant; Lead Free: Lead Free; Height: 0.45mm; RoHS Compliant: Yes; Termination: SMD/SMT; Military Standard: Not; Case Code (Imperial): 0603; Packaging: Tape and Reel; Series: RC; Length: 1.6mm
R13 R16 R18 R20 R22 R24 R26 = CMP-1659-00009-5: RES 1K OHM 1% 1/10W 0603; Voltage Rating: 50V; Power Rating: 100mW; Temperature Coefficient: 100ppm/°C; Military Standard: Not; REACH SVHC: No SVHC; Size Code: 0603; Features: Moisture Resistant; Number of Terminations: 2; Technology: THICK FILM; Series: RC; Case Code (Metric): 1608; Resistance Tolerance: 1%; Resistor Type: Thick Film; Termination: SMD/SMT; Contact Plating: Tin; Radiation Hardening: No; Min Operating Temperature: -55°C; Max Operating Temperature: 155°C; Packaging: Tape and Reel; Max Power Dissipation: 100mW; RoHS Compliant: Yes; Height: 0.45mm; Lead Free: Lead Free; Case/Package: 0603; Length: 1.6mm; Tolerance: 1%; Case Code (Imperial): 0603; Construction: Rectangular; Depth: 0.8mm
R14 = CMP-2003-04301-2: RES SMD 120 OHM 1% 1/4W 1206; Manufacturer: Yageo; Value: 120Ω; Temperature Coefficient: 50 ppm/°C; Voltage Rating: 200V; Power Rating: 0.25W; Tolerance: 0.0002; Package: RT1206; Mouser Description: Thin Film Resistors - SMD 1/4W 120 ohm 1% 50ppm; Digikey Description: RES SMD 120 OHM 1% 1/4W 1206; Manufacturer Part Number: RT1206FRE07120RL; Temperature Range Low: -55°C; Height: 0.65mm; Footprint Url: http://www.yageo.com/exep/pages/download/literatures/PYu-R_Mount_10.pdf; Octopart: https://octopart.com/rt1206fre07120rl-yageo-1433320; Device Class L3: Chip SMD Resistors; Automotive: No; Temperature: -55°C to +155°C; Series: RT; Category: Res; ComponentLink2URL: http://www.yageo.com/documents/recent/PYu-RT_1-to-0.01_RoHS_L_9.pdf; Temperature Range High: +155°C; Ipc Land Pattern Name: RESC310160X55; Device Class L1: Passive Components; Device Class L2: Resistors; ComponentLink2Description: Datasheet; RoHS: TRUE; Lead Free: Yes; Composition: Thin Film
R35-R41 = CMP-2100-03670-1: Chip Resistor, 10 Ohm, +/- 1%, 0.125 W, -55 to 155 degC, 0805 (2012 Metric), RoHS, Tape and Reel; Manufacturer: Yageo; Power Rating: 125mW; Voltage Rating: 150V; Temperature Coefficient: 200ppm/degreesC; Number of Pins: 2; REACH SVHC: NoSVHC; Datasheet Version: Rev. 5, 10/2016; Max Operating Temperature: 155degC; Manufacturer URL: http://www.yageo.com/; Case Code (Imperial): 0805; Package Description: 2-Pin Surface Mounted Device, Body 2 x 1.25 mm; Case Code (Metric): 2012; Length: 2mm; RoHSCompliant: true; Max Power Dissipation: 125mW; Depth: 1.25mm; Packaging: TapeandReel; Height: 0.5mm; Package Reference: 0805; Package Quantity: 1; Tolerance: 1%; Termination: SMD/SMT; Min Operating Temperature: -55degC; Lead Free: LeadFree; Width: 1.25mm; Voltage Rating (DC): 150V; Datasheet URL: http://www.yageo.com/NewPortal/yageodocoutput?fileName=/pdf/R-Chip/PYu-RC_Group_51_RoHS_L_5.pdf; Composition: ThickFilm; Number of Terminations: 2; Case/Package: 0805

## Sheet InputCircuits1.SchDoc
size A4; SheetNumber: 4; SheetTotal: 6
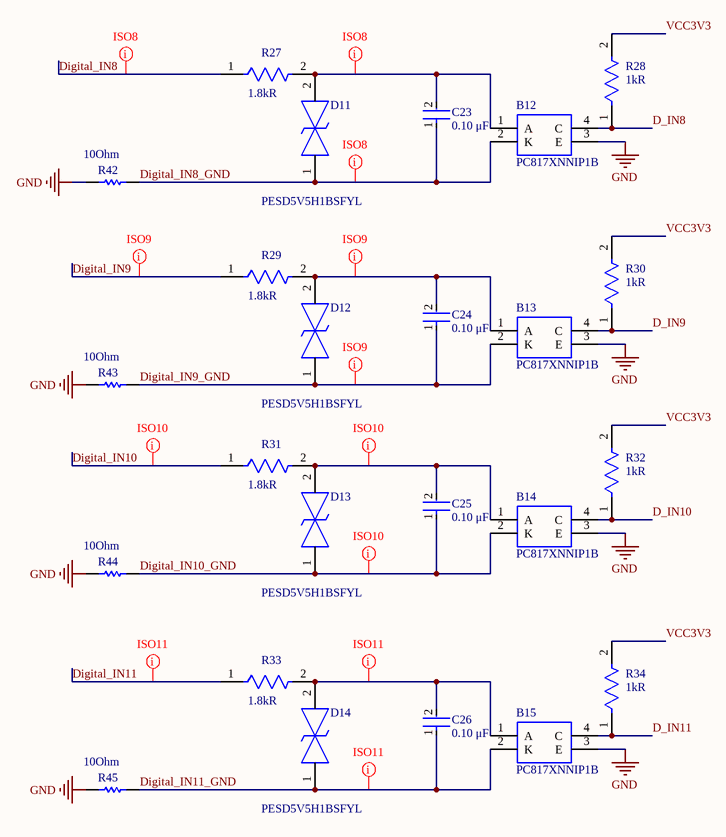
[diagram p3: InputCircuits1.SchDoc]

### Parts
B12  PC817XNNIP1B  [SOP254P960X420-4N]
B13  PC817XNNIP1B  [SOP254P960X420-4N]
B14  PC817XNNIP1B  [SOP254P960X420-4N]
B15  PC817XNNIP1B  [SOP254P960X420-4N]
C23  value 0.10 μF  [FP-C0805C-DN-MFG]  (hidden comment: C0805C104K5RAC7411)
C24  value 0.10 μF  [FP-C0805C-DN-MFG]  (hidden comment: C0805C104K5RAC7411)
C25  value 0.10 μF  [FP-C0805C-DN-MFG]  (hidden comment: C0805C104K5RAC7411)
C26  value 0.10 μF  [FP-C0805C-DN-MFG]  (hidden comment: C0805C104K5RAC7411)
D11  PESD5V5H1BSFYL  [PESD5V0H1BSFYL]
D12  PESD5V5H1BSFYL  [PESD5V0H1BSFYL]
D13  PESD5V5H1BSFYL  [PESD5V0H1BSFYL]
D14  PESD5V5H1BSFYL  [PESD5V0H1BSFYL]
R27  Resistance: 1.8kR  [FP-RC0603-0_55-IPC_C]  (hidden comment: RC0603FR-071K8L)
R28  Resistance: 1kR  [FP-RC0603-0_55-IPC_C]  (hidden comment: RC0603FR-071KL)
R29  Resistance: 1.8kR  [FP-RC0603-0_55-IPC_C]  (hidden comment: RC0603FR-071K8L)
R30  Resistance: 1kR  [FP-RC0603-0_55-IPC_C]  (hidden comment: RC0603FR-071KL)
R31  Resistance: 1.8kR  [FP-RC0603-0_55-IPC_C]  (hidden comment: RC0603FR-071K8L)
R32  Resistance: 1kR  [FP-RC0603-0_55-IPC_C]  (hidden comment: RC0603FR-071KL)
R33  Resistance: 1.8kR  [FP-RC0603-0_55-IPC_C]  (hidden comment: RC0603FR-071K8L)
R34  Resistance: 1kR  [FP-RC0603-0_55-IPC_C]  (hidden comment: RC0603FR-071KL)
R42  Resistance: 10Ohm  [RESC2013X60X35ML10T20]  (hidden comment: RC0805FR-0710RL)
R43  Resistance: 10Ohm  [RESC2013X60X35ML10T20]  (hidden comment: RC0805FR-0710RL)
R44  Resistance: 10Ohm  [RESC2013X60X35ML10T20]  (hidden comment: RC0805FR-0710RL)
R45  Resistance: 10Ohm  [RESC2013X60X35ML10T20]  (hidden comment: RC0805FR-0710RL)

### Nets
GND: B12.3(E) B13.3(E) B14.3(E) B15.3(E) R42.1 R43.1 R44.1 R45.1
D_IN8: B12.4(C) R28.1
D_IN9: B13.4(C) R30.1
D_IN10: B14.4(C) R32.1
D_IN11: B15.4(C) R34.1
Digital_IN8: R27.1
Digital_IN8_GND: B12.2(K) C23.1 D11.1 R42.2
Digital_IN9: R29.1
Digital_IN9_GND: B13.2(K) C24.1 D12.1 R43.2
Digital_IN10: R31.1
Digital_IN10_GND: B14.2(K) C25.1 D13.1 R44.2
Digital_IN11: R33.1
Digital_IN11_GND: B15.2(K) C26.1 D14.1 R45.2
VCC3V3: R28.2 R30.2 R32.2 R34.2
NetB12_1: B12.1(A) C23.2 D11.2 R27.2
NetB13_1: B13.1(A) C24.2 D12.2 R29.2
NetB14_1: B14.1(A) C25.2 D13.2 R31.2
NetB15_1: B15.1(A) C26.2 D14.2 R33.2

### Layout directives
net class ISO8: Digital_IN8, Digital_IN8_GND, NetB12_1
net class ISO9: Digital_IN9, Digital_IN9_GND, NetB13_1
net class ISO10: Digital_IN10, Digital_IN10_GND, NetB14_1
net class ISO11: Digital_IN11, Digital_IN11_GND, NetB15_1

### Library data of the parts
B12-B15 = PC817XNNIP1B: as B5 on sheet InputCircuits; Mouser Part Number: 852-PC817XNNIP1B; Mouser Price/Stock: https://www.mouser.co.uk/ProductDetail/Sharp-Microelectronics/PC817XNNIP1B?qs=rrS6PyfT74dJvnx7366b6Q%3D%3D; Manufacturer_Part_Number: PC817XNNIP1B; Datasheet Link: *
C23-C26 = CMP-2007-00277-3: as C27 on sheet MainPage; Temperature: -55°C to +125°C; Device Class L3: Ceramic Capacitors; Temperature Characteristic: X7R; Device Class L1: Passive Components; Category: Cap; Temperature Coefficient: 30ppm/°C; Manufacturer Part Number: C0805C104K5RAC7411; Temperature Range High: +125°C; Height: 0.88mm; RoHS: TRUE; ComponentLink2Description: Datasheet; Lead Free: Yes; Capacitance: 0.10 μF; Package: C0805C-DN; Temperature Range Low: -55°C; ComponentLink2URL: https://content.kemet.com/datasheets/KEM_C1003_C0G_SMD.pdf; Automotive: No; Ipc Land Pattern Name: CAPC200125X78; Octopart: https://octopart.com/c0805c104k5rac7411-kemet-18508045; Device Class L2: Capacitors
D11-D14 = PESD5V5H1BSFYL: as D3 on sheet InputCircuits; Mouser Part Number: 771-PESD5V5H1BSFYL; Mouser Price/Stock: https://www.mouser.co.uk/ProductDetail/Nexperia/PESD5V5H1BSFYL?qs=T3oQrply3y9CfA%2FMHqAcog%3D%3D; Manufacturer_Part_Number: PESD5V5H1BSFYL; Datasheet Link: https://assets.nexperia.com/documents/data-sheet/PESD5V0H1BSF.pdf
R27 R29 R31 R33 = CMP-2000-06931-2: as R12 on sheet InputCircuits; REACH SVHC: No SVHC; Construction: Rectangular; Resistance Tolerance: 1%; Package Quantity: 5000; Tolerance: 1%; Min Operating Temperature: -55°C; Case Code (Metric): 1608; Number of Terminations: 2; Case/Package: 0603; Number of Pins: 2; Max Power Dissipation: 100mW; Max Operating Temperature: 155°C; Technology: THICK FILM; Resistor Type: Thick Film; Voltage Rating: 50V; Depth: 0.8mm; Size Code: 0603; Width: 0.8mm; Features: Moisture Resistant; Lead Free: Lead Free; Height: 0.45mm; RoHS Compliant: Yes; Termination: SMD/SMT; Military Standard: Not; Case Code (Imperial): 0603; Packaging: Tape and Reel; Series: RC; Length: 1.6mm
R28 R30 R32 R34 = CMP-1659-00009-5: as R13 on sheet InputCircuits; Military Standard: Not; REACH SVHC: No SVHC; Size Code: 0603; Features: Moisture Resistant; Number of Terminations: 2; Technology: THICK FILM; Series: RC; Case Code (Metric): 1608; Resistance Tolerance: 1%; Resistor Type: Thick Film; Termination: SMD/SMT; Contact Plating: Tin; Radiation Hardening: No; Min Operating Temperature: -55°C; Max Operating Temperature: 155°C; Packaging: Tape and Reel; Max Power Dissipation: 100mW; RoHS Compliant: Yes; Height: 0.45mm; Lead Free: Lead Free; Case/Package: 0603; Length: 1.6mm; Tolerance: 1%; Case Code (Imperial): 0603; Construction: Rectangular; Depth: 0.8mm
R42-R45 = CMP-2100-03670-1: as R35 on sheet InputCircuits; Number of Pins: 2; REACH SVHC: NoSVHC; Datasheet Version: Rev. 5, 10/2016; Max Operating Temperature: 155degC; Manufacturer URL: http://www.yageo.com/; Case Code (Imperial): 0805; Package Description: 2-Pin Surface Mounted Device, Body 2 x 1.25 mm; Case Code (Metric): 2012; Length: 2mm; RoHSCompliant: true; Max Power Dissipation: 125mW; Depth: 1.25mm; Packaging: TapeandReel; Height: 0.5mm; Package Reference: 0805; Package Quantity: 1; Tolerance: 1%; Termination: SMD/SMT; Min Operating Temperature: -55degC; Lead Free: LeadFree; Width: 1.25mm; Voltage Rating (DC): 150V; Datasheet URL: http://www.yageo.com/NewPortal/yageodocoutput?fileName=/pdf/R-Chip/PYu-RC_Group_51_RoHS_L_5.pdf; Composition: ThickFilm; Number of Terminations: 2; Case/Package: 0805

## Sheet indication.SchDoc
size A4; SheetNumber: 5; SheetTotal: 6
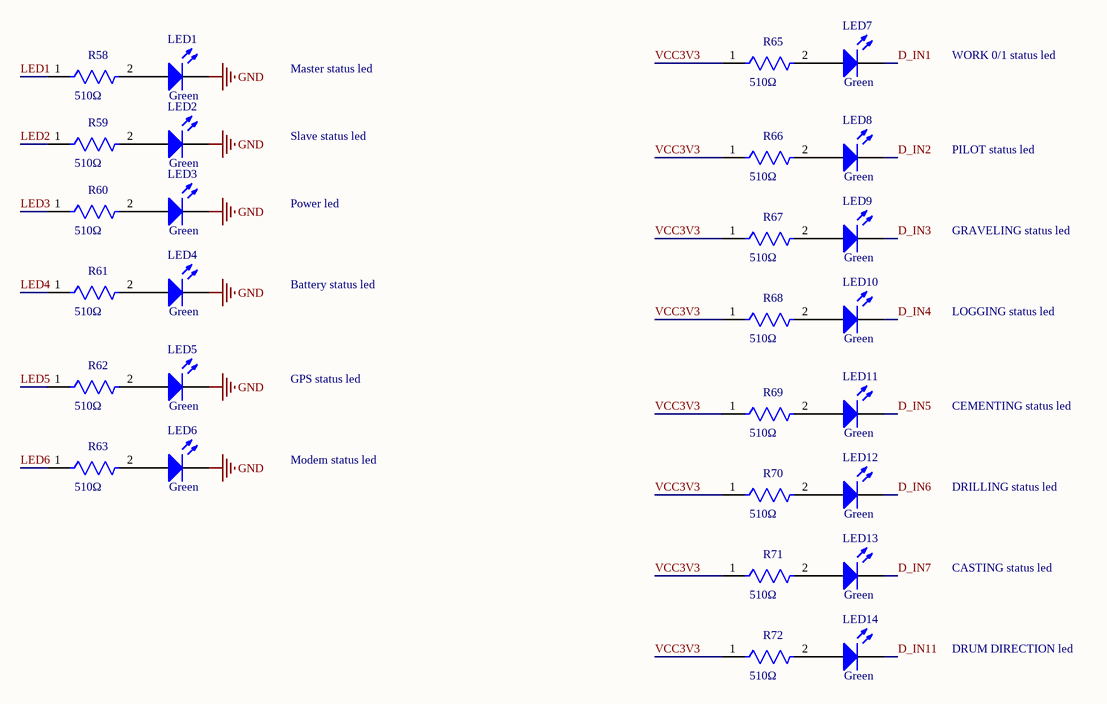
[diagram p4: indication.SchDoc]

### Parts
LED1  Color: Green  [0805_A]  (hidden comment: 150080GS75000)
LED2  Color: Green  [0805_A]  (hidden comment: 150080GS75000)
LED3  Color: Green  [0805_A]  (hidden comment: 150080GS75000)
LED4  Color: Green  [0805_A]  (hidden comment: 150080GS75000)
LED5  Color: Green  [0805_A]  (hidden comment: 150080GS75000)
LED6  Color: Green  [0805_A]  (hidden comment: 150080GS75000)
LED7  Color: Green  [0805_A]  (hidden comment: 150080GS75000)
LED8  Color: Green  [0805_A]  (hidden comment: 150080GS75000)
LED9  Color: Green  [0805_A]  (hidden comment: 150080GS75000)
LED10  Color: Green  [0805_A]  (hidden comment: 150080GS75000)
LED11  Color: Green  [0805_A]  (hidden comment: 150080GS75000)
LED12  Color: Green  [0805_A]  (hidden comment: 150080GS75000)
LED13  Color: Green  [0805_A]  (hidden comment: 150080GS75000)
LED14  Color: Green  [0805_A]  (hidden comment: 150080GS75000)
R58  Resistance: 510Ω  [FP-AC0805-MFG]  (hidden comment: AC0805FR-07510RL)
R59  Resistance: 510Ω  [FP-AC0805-MFG]  (hidden comment: AC0805FR-07510RL)
R60  Resistance: 510Ω  [FP-AC0805-MFG]  (hidden comment: AC0805FR-07510RL)
R61  Resistance: 510Ω  [FP-AC0805-MFG]  (hidden comment: AC0805FR-07510RL)
R62  Resistance: 510Ω  [FP-AC0805-MFG]  (hidden comment: AC0805FR-07510RL)
R63  Resistance: 510Ω  [FP-AC0805-MFG]  (hidden comment: AC0805FR-07510RL)
R65  Resistance: 510Ω  [FP-AC0805-MFG]  (hidden comment: AC0805FR-07510RL)
R66  Resistance: 510Ω  [FP-AC0805-MFG]  (hidden comment: AC0805FR-07510RL)
R67  Resistance: 510Ω  [FP-AC0805-MFG]  (hidden comment: AC0805FR-07510RL)
R68  Resistance: 510Ω  [FP-AC0805-MFG]  (hidden comment: AC0805FR-07510RL)
R69  Resistance: 510Ω  [FP-AC0805-MFG]  (hidden comment: AC0805FR-07510RL)
R70  Resistance: 510Ω  [FP-AC0805-MFG]  (hidden comment: AC0805FR-07510RL)
R71  Resistance: 510Ω  [FP-AC0805-MFG]  (hidden comment: AC0805FR-07510RL)
R72  Resistance: 510Ω  [FP-AC0805-MFG]  (hidden comment: AC0805FR-07510RL)

### Nets
GND: LED1.1(K) LED2.1(K) LED3.1(K) LED4.1(K) LED5.1(K) LED6.1(K)
D_IN1: LED7.1(K)
D_IN2: LED8.1(K)
D_IN3: LED9.1(K)
D_IN4: LED10.1(K)
D_IN5: LED11.1(K)
D_IN6: LED12.1(K)
D_IN7: LED13.1(K)
D_IN11: LED14.1(K)
LED1: R58.1
LED2: R59.1
LED3: R60.1
LED4: R61.1
LED5: R62.1
LED6: R63.1
VCC3V3: R65.1 R66.1 R67.1 R68.1 R69.1 R70.1 R71.1 R72.1
NetLED1_2: LED1.2(A) R58.2
NetLED2_2: LED2.2(A) R59.2
NetLED3_2: LED3.2(A) R60.2
NetLED4_2: LED4.2(A) R61.2
NetLED5_2: LED5.2(A) R62.2
NetLED6_2: LED6.2(A) R63.2
NetLED7_2: LED7.2(A) R65.2
NetLED8_2: LED8.2(A) R66.2
NetLED9_2: LED9.2(A) R67.2
NetLED10_2: LED10.2(A) R68.2
NetLED11_2: LED11.2(A) R69.2
NetLED12_2: LED12.2(A) R70.2
NetLED13_2: LED13.2(A) R71.2
NetLED14_2: LED14.2(A) R72.2

### Notes on the sheet
- Master status led
- WORK 0/1 status led
- Slave status led
- PILOT status led
- Power led
- Battery status led
- GRAVELING status led
- LOGGING status led
- GPS status led
- CEMENTING status led
- Modem status led
- DRILLING status led
- CASTING status led
- DRUM DIRECTION led

### Library data of the parts
LED1-LED14 = CMP-1426-00007-1: SMD mono-color Chip LED, WL-SMCW, Green; Manufacturer: Wuerth Elektronik; PackageReference: 0805_A; PartNumber: 150080GS75000; ComponentLink2URL: http://katalog.we-online.com/led/datasheet/150080GS75000.pdf; ComponentLink1URL: http://www.we-online.com; ComponentLink1Description: Manufacturer URL; ComponentLink2Description: Datasheet
R58-R63 R65-R72 = CMP-03412-037669-1: RES SMD 510 OHM 1% 1/8W 0805; Manufacturer: Yageo; Automotive Grade: Grade 0; Value: 510Ω; Tolerance: 0.01; Voltage Rating: 150V; Device Class L2: Resistors; Series: AC; Footprint Url: http://www.yageo.com/exep/pages/download/literatures/PYu-R_Mount_10.pdf; Height: 0.6mm; Composition: Thick Film; Device Class L1: Passive Components; Power Rating: 1/8W; Category: Res; Package: AC0805; Digikey Description: RES SMD 510 OHM 1% 1/8W 0805; Manufacturer Part Number: AC0805FR-07510RL; Lead Free: Yes; ComponentLink2URL: http://www.yageo.com/documents/recent/PYu-AC_51_RoHS_L_6.pdf; Ipc Land Pattern Name: RESC200125X50; RoHS: TRUE; Device Class L3: Chip SMD Resistors; Automotive: Yes; Temperature: -55°C to +155°C; Temperature Range High: +155°C; ComponentLink2Description: Datasheet; Octopart: https://octopart.com/ac0805fr-07510rl-yageo-71367760; Mouser Description: Thick Film Resistors - SMD 1/8W 510ohm 1% AEC-Q200; Temperature Range Low: -55°C